# EAGLE design Robot (EAGLE 9.6.2)
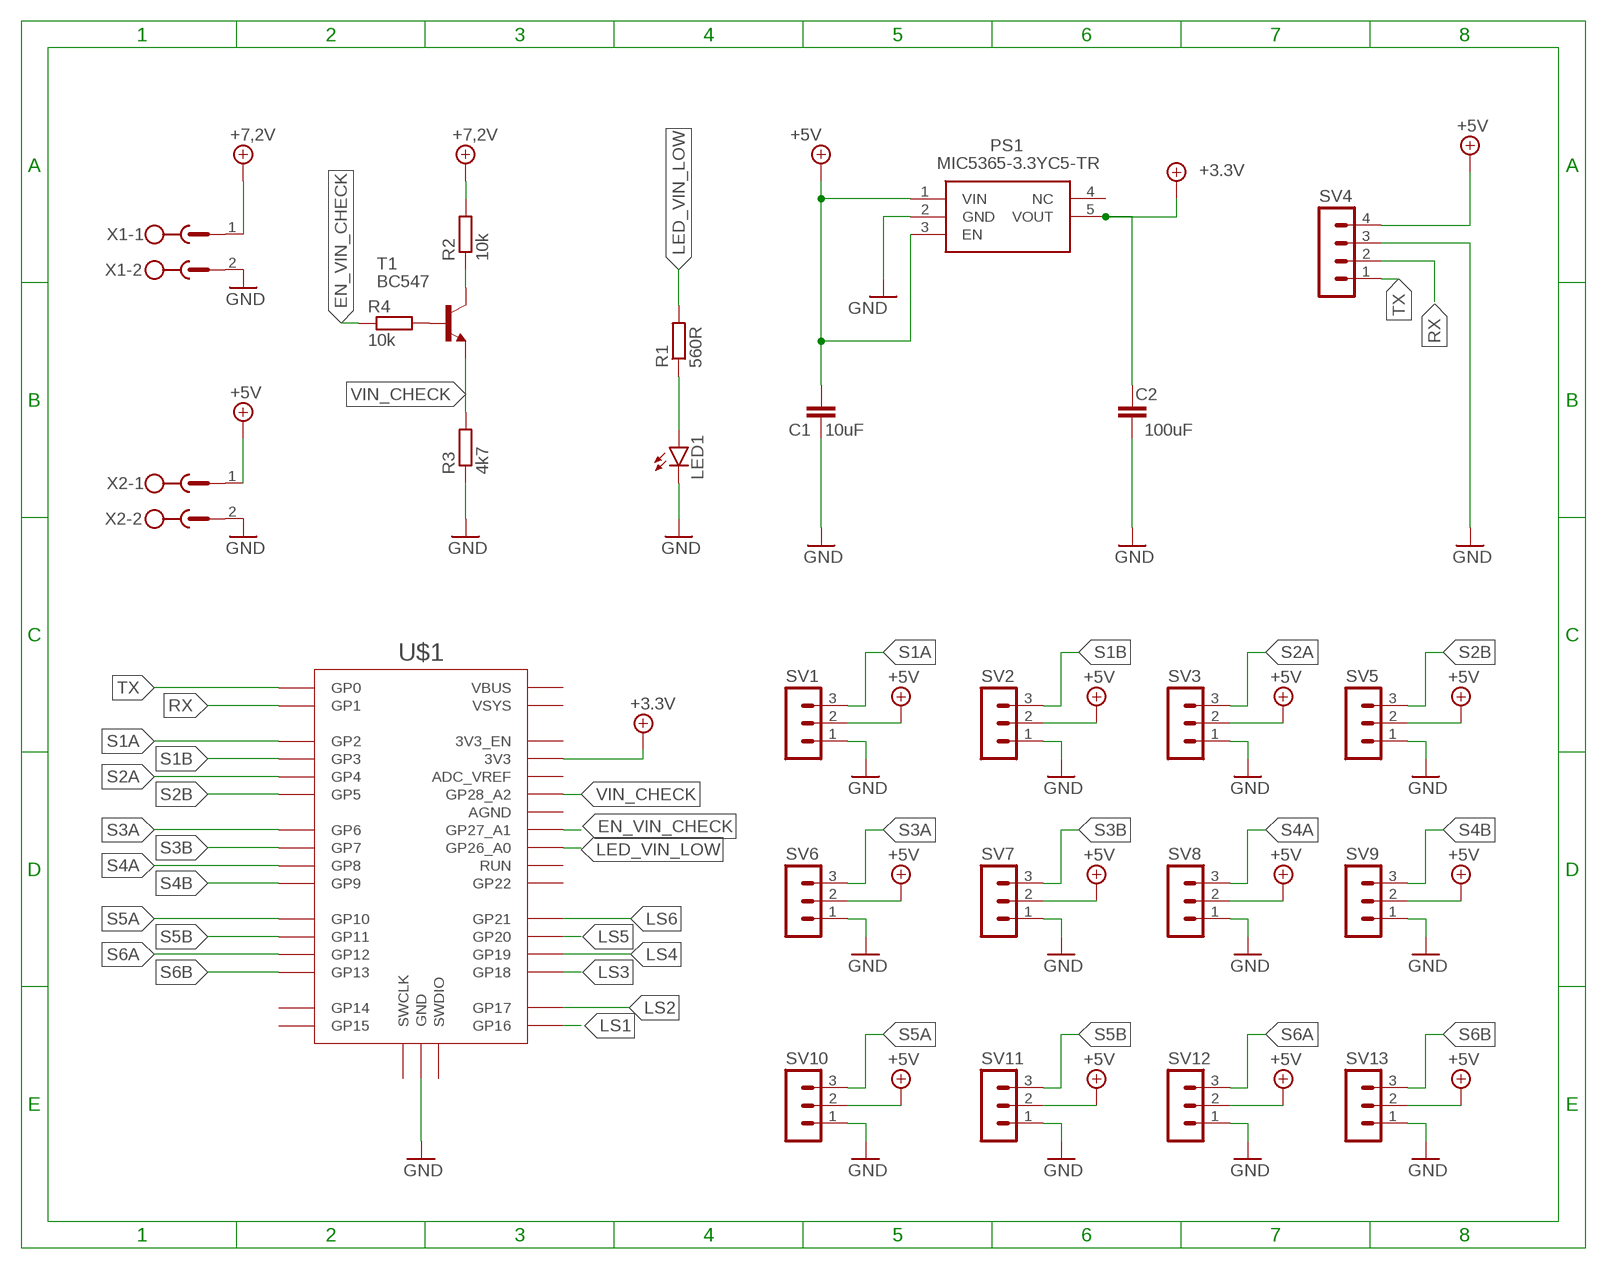
[diagram p0: schematic, sheet 1]

## Parts
C1  10uF  C-EUC1206  [C1206]
C2  100uF  C-EUC1206  [C1206]
LED1  LEDCHIPLED_1206  [CHIPLED_1206]
PS1  MIC5365-3.3YC5-TR  [SOT65P210X110-5N]
R1  560R  R-EU_R1206  [R1206]
R2  10k  R-EU_R1206  [R1206]
R3  4k7  R-EU_R1206  [R1206]
R4  10k  R-EU_0204/7  [0204/7]
SV1  MA03-1  [MA03-1]
SV2  MA03-1  [MA03-1]
SV3  MA03-1  [MA03-1]
SV4  MA04-1  [MA04-1]
SV5  MA03-1  [MA03-1]
SV6  MA03-1  [MA03-1]
SV7  MA03-1  [MA03-1]
SV8  MA03-1  [MA03-1]
SV9  MA03-1  [MA03-1]
SV10  MA03-1  [MA03-1]
SV11  MA03-1  [MA03-1]
SV12  MA03-1  [MA03-1]
SV13  MA03-1  [MA03-1]
T1  BC547  [TO92]
U$1  RPI_PICO-TH  [RPI_PICO_TH]
X1  MSTBV2  [MSTBV2]
X2  MSTBV2  [MSTBV2]

## Nets
+3.3V: C2.2 PS1.5(VOUT) U$1.3V3
+5V: C1.2 PS1.1(VIN) PS1.3(EN) SV1.2 SV2.2 SV3.2 SV4.4 SV5.2 SV6.2 SV7.2 SV8.2 SV9.2 SV10.2 SV11.2 SV12.2 SV13.2 X2.1
+9V: R2.2 X1.1 ; supply symbol labelled +7,2V
EN_VIN_CHECK: R4.1 U$1.GP27_A1
GND: C1.1 C2.1 LED1.C PS1.2(GND) R3.1 SV1.1 SV2.1 SV3.1 SV4.3 SV5.1 SV6.1 SV7.1 SV8.1 SV9.1 SV10.1 SV11.1 SV12.1 SV13.1 U$1.GND@1(GND) U$1.GND@2(GND) U$1.GND@3(GND) U$1.GND@4(GND) U$1.GND@5(GND) U$1.GND@6(GND) U$1.GND@7(GND) U$1.GND@8(GND) X1.2 X2.2
LED_VIN_LOW: R1.2 U$1.GP26_A0
LS1: U$1.GP16
LS2: U$1.GP17
LS3: U$1.GP18
LS4: U$1.GP19
LS5: U$1.GP20
LS6: U$1.GP21
N$1: LED1.A R1.1
N$2: R2.1 T1.3(C)
N$3: R4.2 T1.2(B)
RX: SV4.2 U$1.GP1
S1A: SV1.3 U$1.GP2
S1B: SV2.3 U$1.GP3
S2A: SV3.3 U$1.GP4
S2B: SV5.3 U$1.GP5
S3A: SV6.3 U$1.GP6
S3B: SV7.3 U$1.GP7
S4A: SV8.3 U$1.GP8
S4B: SV9.3 U$1.GP9
S5A: SV10.3 U$1.GP10
S5B: SV11.3 U$1.GP11
S6A: SV12.3 U$1.GP12
S6B: SV13.3 U$1.GP13
TX: SV4.1 U$1.GP0
VIN_CHECK: R3.2 T1.1(E) U$1.GP28_A2
Unconnected: PS1.4(NC) U$1.3V3_EN U$1.ADC_VREF U$1.AGND U$1.GP14 U$1.GP15 U$1.GP22 U$1.RUN U$1.SWCLK U$1.SWDIO U$1.VBUS U$1.VSYS

## Library data of the parts
C1 C2 = rcl:C-EU: CAPACITOR, European symbol; SPICEPREFIX: C
LED1 = led:LED: LED OSRAM: - CHIPLED LG R971, LG N971, LY N971, LG Q971, LY Q971, LO R971, LY R971 LH N974, LH R974 LS Q976, LO Q976, LY Q976 LO Q996 - Hyper CHIPLED LW Q18S LB Q993, LB Q99A, LB R99A - SideLED LS A670, LO A670, LY A670, LG A670, LP A670 LB A673, LV A673, LT A673, LW A673 LH A674 LY A675 LS A676, LA A676, LO A676, LY A676, LW A676 LS A679, LY A679, LG A679 - Hyper Micro SIDELED® LS Y876, LA Y876, LO Y876, LY Y876 LT Y87S - SmartLED LW L88C, LW L88S LB L89C, LB L89S, LG L890 LS L89K, LO L89K, LY L89K LS L896, LA L896, LO L896, LY L896 - TOPLED LS T670, LO T670, LY T670, LG T670, LP T670 LSG T670, LSP T670, LSY T670, LOP T670, LYG T670 LG T671, LOG T671, LSG T671 LB T673, LV T673, LT T673, LW T673 LH T674 LS T676, LA T676, LO T676, LY T676, LB T676, LH T676, LSB T676, LW T676 LB T67C, LV T67C, LT T67C, LS T67K, LO T67K, LY T67K, LW E67C LS E67B, LA E67B, LO E67B, LY E67B, LB E67C, LV E67C, LT E67C LW T67C LS T679, LY T679, LG T679 LS T770, LO T770, LY T770, LG T770, LP T770 LB T773, LV T773, LT T773, LW T773 LH T774 LS E675, LA E675, LY E675, LS T675 LS T776, LA T776, LO T776, LY T776, LB T776 LHGB T686 LT T68C, LB T68C - Hyper Mini TOPLED® LB M676 - Mini TOPLED Santana® LG M470 LS M47K, LO M47K, LY M47K Source: http://www.osram.convergy.de LUXEON: - LUMILED® LXK2-PW12-R00, LXK2-PW12-S00, LXK2-PW14-U00, LXK2-PW14-V00 LXK2-PM12-R00, LXK2-PM12-S00, LXK2-PM14-U00 LXK2-PE12-Q00, LXK2-PE12-R00, LXK2-PE12-S00, LXK2-PE14-T00, LXK2-PE14-U00 LXK2-PB12-K00, LXK2-PB12-L00, LXK2-PB12-M00, LXK2-PB14-N00, LXK2-PB14-P00, LXK2-PB14-Q00 LXK2-PR12-L00, LXK2-PR12-M00, LXK2-PR14-Q00, LXK2-PR14-R00 LXK2-PD12-Q00, LXK2-PD12-R00, LXK2-PD12-S00 LXK2-PH12-R00, LXK2-PH12-S00 LXK2-PL12-P00, LXK2-PL12-Q00, LXK2-PL12-R00 Source: www.luxeon.com KINGBRIGHT: KA-3528ASYC Source: www.kingbright.com
PS1 = MIC5365-3.3YC5-TR:MIC5365-3.3YC5-TR: MICROCHIP - MIC5365-3.3YC5-TR - LDO, FIXED, 3.3V, 0.15A, SC-70-5 Source: Datasheet <http://www.mouser.com/ds/2/268/mic5365-779177.pdf>; ARROW_PART_NUMBER: MIC5365-3.3YC5-TR; ARROW_PRICE-STOCK: https://www.arrow.com/en/products/mic5365-3.3yc5-tr/microchip-technology?region=nac; DESCRIPTION: MICROCHIP - MIC5365-3.3YC5-TR - LDO, FIXED, 3.3V, 0.15A, SC-70-5; HEIGHT: 1.1mm; MANUFACTURER_NAME: Microchip; MANUFACTURER_PART_NUMBER: MIC5365-3.3YC5-TR; MOUSER_PART_NUMBER: 998-MIC5365-3.3YC5TR; MOUSER_PRICE-STOCK: https://www.mouser.co.uk/ProductDetail/Microchip-Technology-Micrel/MIC5365-33YC5-TR?qs=U6T8BxXiZAXvJj%252BPZ%252B301w%3D%3D
R1-R4 = rcl:R-EU_: RESISTOR, European symbol; SPICEPREFIX: R
SV1-SV3 SV5-SV13 = con-lstb:MA03-1: PIN HEADER; OC_FARNELL: unknown; OC_NEWARK: unknown
SV4 = con-lstb:MA04-1: PIN HEADER; OC_FARNELL: unknown; OC_NEWARK: unknown
T1 = transistor:BC547: NPN TRANSISTOR
U$1 = RaspberryPi_Pico:RPI_PICO
X1 X2 = con-phoenix-500:MSTBV2: PHOENIX; OC_FARNELL: unknown; OC_NEWARK: unknown

## Board
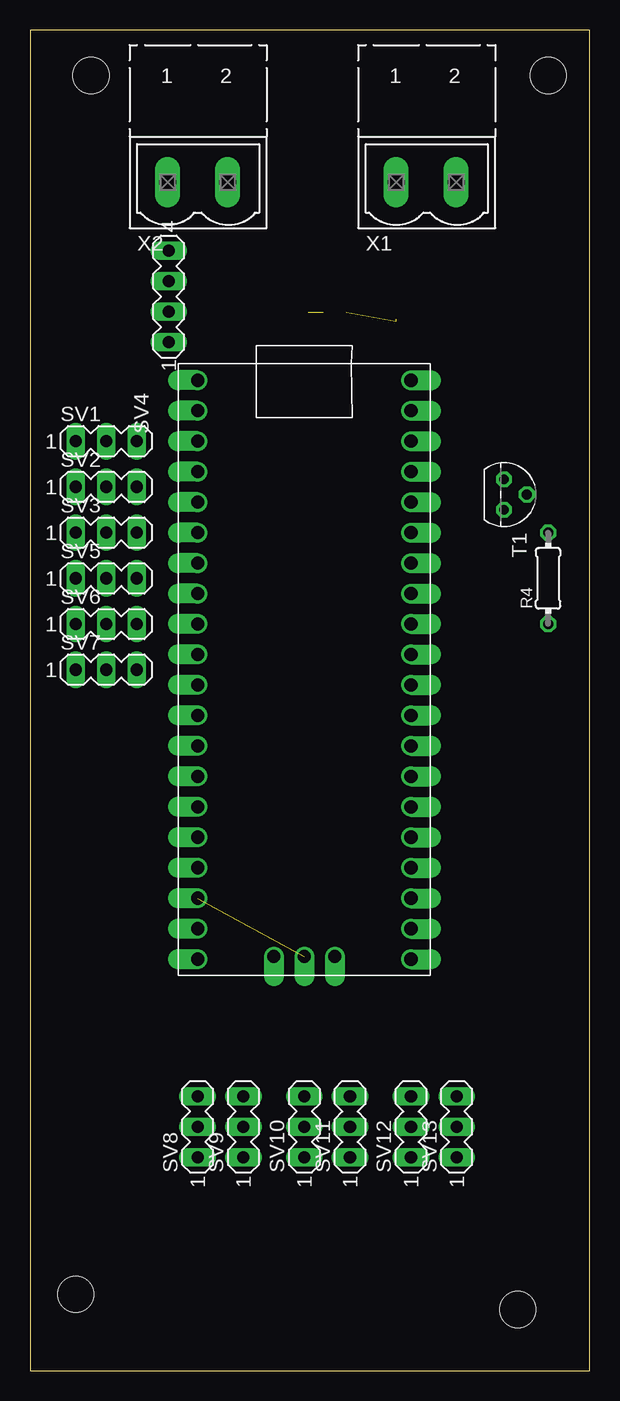
[diagram p1: board, top side]
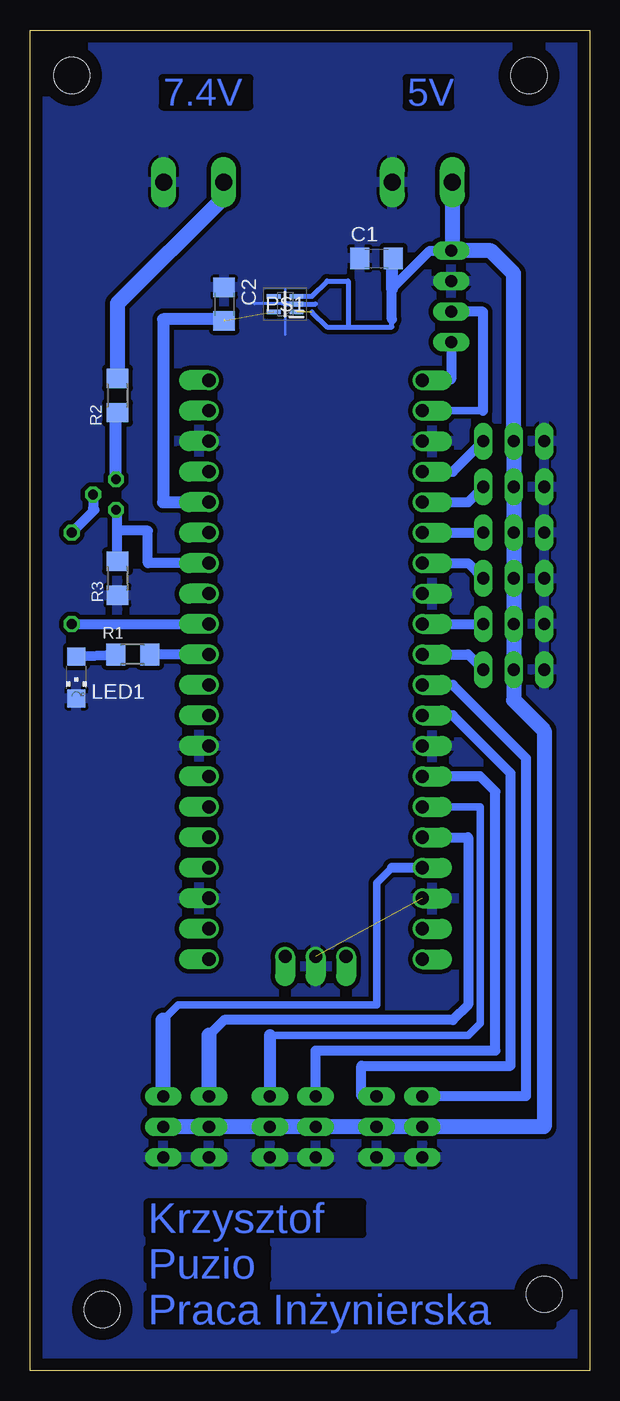
[diagram p2: board, bottom side, seen from below]

Size 46.66 x 111.75 mm. Coordinates in mm from the lower left corner, seen from the top.
Outline: 0,0 46.66,0 46.66,111.75 0,111.75 0,0
Copper layers (1*16): Top 0.035mm / dielectric 0.15mm / Bottom 0.035mm
Design rules "default *": minimum track width 6mil, minimum drill 0.35mm, track to track 10mil, track to pad 10mil, pad to pad 10mil, via to via 10mil, smd to smd 6mil, copper to edge 40mil, drill to drill 6mil, minimum pad ring 10mil, minimum via ring 8mil, stop-mask expansion 4mil, vias tented up to drill 0mil, thermal gap 10mil
Holes 3 mm at 3.81,6.35 40.64,5.08 43.18,107.95 5.08,107.95

### Footprints (pad centres in the part's own frame; a part is rotated, then mirrored left to right if it is on the bottom)
C1206 = smd 1.6 x 1.8: 1 -1.4,0; 2 1.4,0
CHIPLED_1206 = smd 1.5 x 1.5: A 0,-1.75; C 0,1.75
SOT65P210X110-5N = smd 1.15 x 0.4: 1 -0.95,0.65; 2 -0.95,0; 3 -0.95,-0.65; 4 0.95,-0.65; 5 0.95,0.65
R1206 = smd 1.6 x 1.803: 1 -1.422,0; 2 1.422,0
0204/7 = drill 0.813 octagon: 1 -3.81,0; 2 3.81,0
MA03-1 = drill 1.016 long: 1 -2.54,0; 2 0,0; 3 2.54,0
MA04-1 = drill 1.016 long: 1 -3.81,0; 2 -1.27,0; 3 1.27,0; 4 3.81,0
TO92 = drill 0.813 octagon: 1 1.27,0; 2 0,1.905; 3 -1.27,0
RPI_PICO_TH = drill 1.1 pad 1.6 offset: 3V3 8.89,13.97; 3V3_EN 8.89,16.51; ADC_VREF 8.89,11.43; AGND 8.89,6.35; GND@1 -8.89,19.05; GND@2 -8.89,6.35; GND@3 -8.89,-6.35; GND@4 -8.89,-19.05; GND@5 0,-23.9; GND@6 8.89,-19.05; GND@7 8.89,-6.35; GND@8 8.89,19.05; GP0 -8.89,24.13; GP1 -8.89,21.59; GP2 -8.89,16.51; GP3 -8.89,13.97; GP4 -8.89,11.43; GP5 -8.89,8.89; GP6 -8.89,3.81; GP7 -8.89,1.27; GP8 -8.89,-1.27; GP9 -8.89,-3.81; GP10 -8.89,-8.89; GP11 -8.89,-11.43; GP12 -8.89,-13.97; GP13 -8.89,-16.51; GP14 -8.89,-21.59; GP15 -8.89,-24.13; GP16 8.89,-24.13; GP17 8.89,-21.59; GP18 8.89,-16.51; GP19 8.89,-13.97; GP20 8.89,-11.43; GP21 8.89,-8.89; GP22 8.89,-3.81; GP26_A0 8.89,1.27; GP27_A1 8.89,3.81; GP28_A2 8.89,8.89; RUN 8.89,-1.27; SWCLK -2.54,-23.9; SWDIO 2.54,-23.9; VBUS 8.89,24.13; VSYS 8.89,21.59
MSTBV2 = drill 1.397 long: 1 -2.5,0; 2 2.5,0

### Placement (x,y rotation side)
C1  17.78,92.71 0 bottom
C2  30.48,88.9 270 bottom
LED1  42.8,57.78 180 bottom
PS1  25.4,88.9 180 bottom
R1  38.1,59.69 0 bottom
R2  39.37,81.28 90 bottom
R3  39.37,66.04 90 bottom
R4  43.18,66.04 90 top
SV1  6.35,77.47 0 top
SV2  6.35,73.66 0 top
SV3  6.35,69.85 0 top
SV4  11.56,89.53 90 top
SV5  6.35,66.04 0 top
SV6  6.35,62.23 0 top
SV7  6.35,58.42 0 top
SV8  13.97,20.32 90 top
SV9  17.78,20.32 90 top
SV10  22.86,20.32 90 top
SV11  26.67,20.32 90 top
SV12  31.75,20.32 90 top
SV13  35.56,20.32 90 top
T1  39.5,73.03 270 top
U$1  22.86,58.42 0 top
X1  33.02,99.06 0 top
X2  13.97,99.06 0 top

### Tracks (layer width: path | path; a pad name or v marks a point on that pad's centre or on a via)
+3.3V  (2 unrouted)
  Bottom 1.016: U$1.3V3 35.56,72.39 35.56,87.63 30.48,87.63
+5V  (1 unrouted)
  Bottom 0.406: 16.51,87.63 16.51,86.98 20.16,86.98 | 23.18,88.25 21.91,86.98 20.16,86.98 | PS1.3 23.18,89.55 21.91,90.82 20.16,90.82 20.16,86.98
  Bottom 0.813: 16.51,87.63 16.51,90.17 13.34,93.34 SV4.4
  Bottom 1.016: C1.2 16.51,92.58 16.51,90.17
  Bottom 1.27: SV13.2 SV12.2 SV11.2 SV10.2 SV9.2 SV8.2 3.81,20.32 3.81,53.34 6.35,55.88 SV7.2 SV6.2 SV5.2 SV3.2 SV2.2 SV1.2 6.35,91.44 8.26,93.34 SV4.4 11.47,93.43 X2.1
+9V
  Bottom 1.27: X1.1 30.52,97.79 39.37,88.94 R2.2
EN_VIN_CHECK
  Bottom 0.813: R4.1 U$1.GP27_A1
GND  (1 unrouted)
  Bottom 0.203: 25.4,86.36 25.4,88.9 25.4,90.17
  Bottom 0.254: 25.4,88.9 25.66,88.9 25.66,88.94 27.94,88.94
  Bottom 0.305: 25.4,88.9 25.4,88.86
  Bottom 0.406: 22.86,88.9 PS1.2 25.4,88.9
  pour Bottom (isolate 0.381): 0,111.76 46.99,111.76 46.99,1.27 0,1.27
LED_VIN_LOW
  Bottom 0.813: U$1.GP26_A0 R1.2
N$1
  Bottom 0.813: LED1.A R1.1
N$2
  Bottom 0.813: 39.5,79.73 R2.1
  Bottom 1.016: T1.3 39.5,79.73
N$3
  Bottom 0.813: R4.2 41.27,71.75 41.4,71.88 T1.2
RX
  Bottom 0.61: U$1.GP1 8.89,80.01
  Bottom 0.813: SV4.2 8.89,88.27 8.89,80.01
S1A
  Bottom 0.813: U$1.GP2 11.43,74.93 SV1.3
S1B
  Bottom 0.813: U$1.GP3 10.16,72.39 SV2.3
S2A
  Bottom 0.813: U$1.GP4 SV3.3
S2B
  Bottom 0.813: U$1.GP5 10.16,67.31 SV5.3
S3A
  Bottom 0.813: U$1.GP6 SV6.3
S3B
  Bottom 0.813: U$1.GP7 10.16,59.69 SV7.3
S4A
  Bottom 0.813: U$1.GP8 11.43,57.15 5.33,51.05 5.33,22.86 SV8.3
S4B
  Bottom 0.813: SV9.3 19.05,22.86 19.05,25.4 6.6,25.4 6.6,49.78 11.43,54.61 U$1.GP9
S5A
  Bottom 0.813: SV10.3 22.86,26.67 7.87,26.67 7.87,48.26 9.14,49.53 U$1.GP10
S5B
  Bottom 0.61: U$1.GP11 9.14,46.99 9.14,28.96 10.16,27.94 26.67,27.94
  Bottom 1.016: 26.67,27.94 SV11.3
S6A
  Bottom 0.813: U$1.GP12 10.16,44.45 10.16,30.48 11.43,29.21 30.48,29.21 31.75,27.94
  Bottom 1.27: 31.75,27.94 SV12.3
S6B
  Bottom 0.61: 16.51,41.91 17.78,40.64 17.78,30.48 34.29,30.48 35.56,29.21
  Bottom 0.813: U$1.GP13 16.51,41.91
  Bottom 1.27: SV13.3 35.56,29.21
TX
  Bottom 0.61: U$1.GP0 11.53,82.55 11.56,82.63
  Bottom 0.813: SV4.1 11.56,82.63
VIN_CHECK
  Bottom 0.813: U$1.GP28_A2 36.83,67.31 36.83,70 39.22,70 39.37,69.85 | R3.2 39.37,69.85 | 39.37,69.85 39.37,71.63 T1.1

### Text on the board
Bottom: 5V | 7.4V | Krzysztof | Puzio | Praca Inżynierska